# EAGLE design RHD2000_plating_board (EAGLE 6.5.0)
RHD2000 Evaluation Board

## Sheet 1 of 4
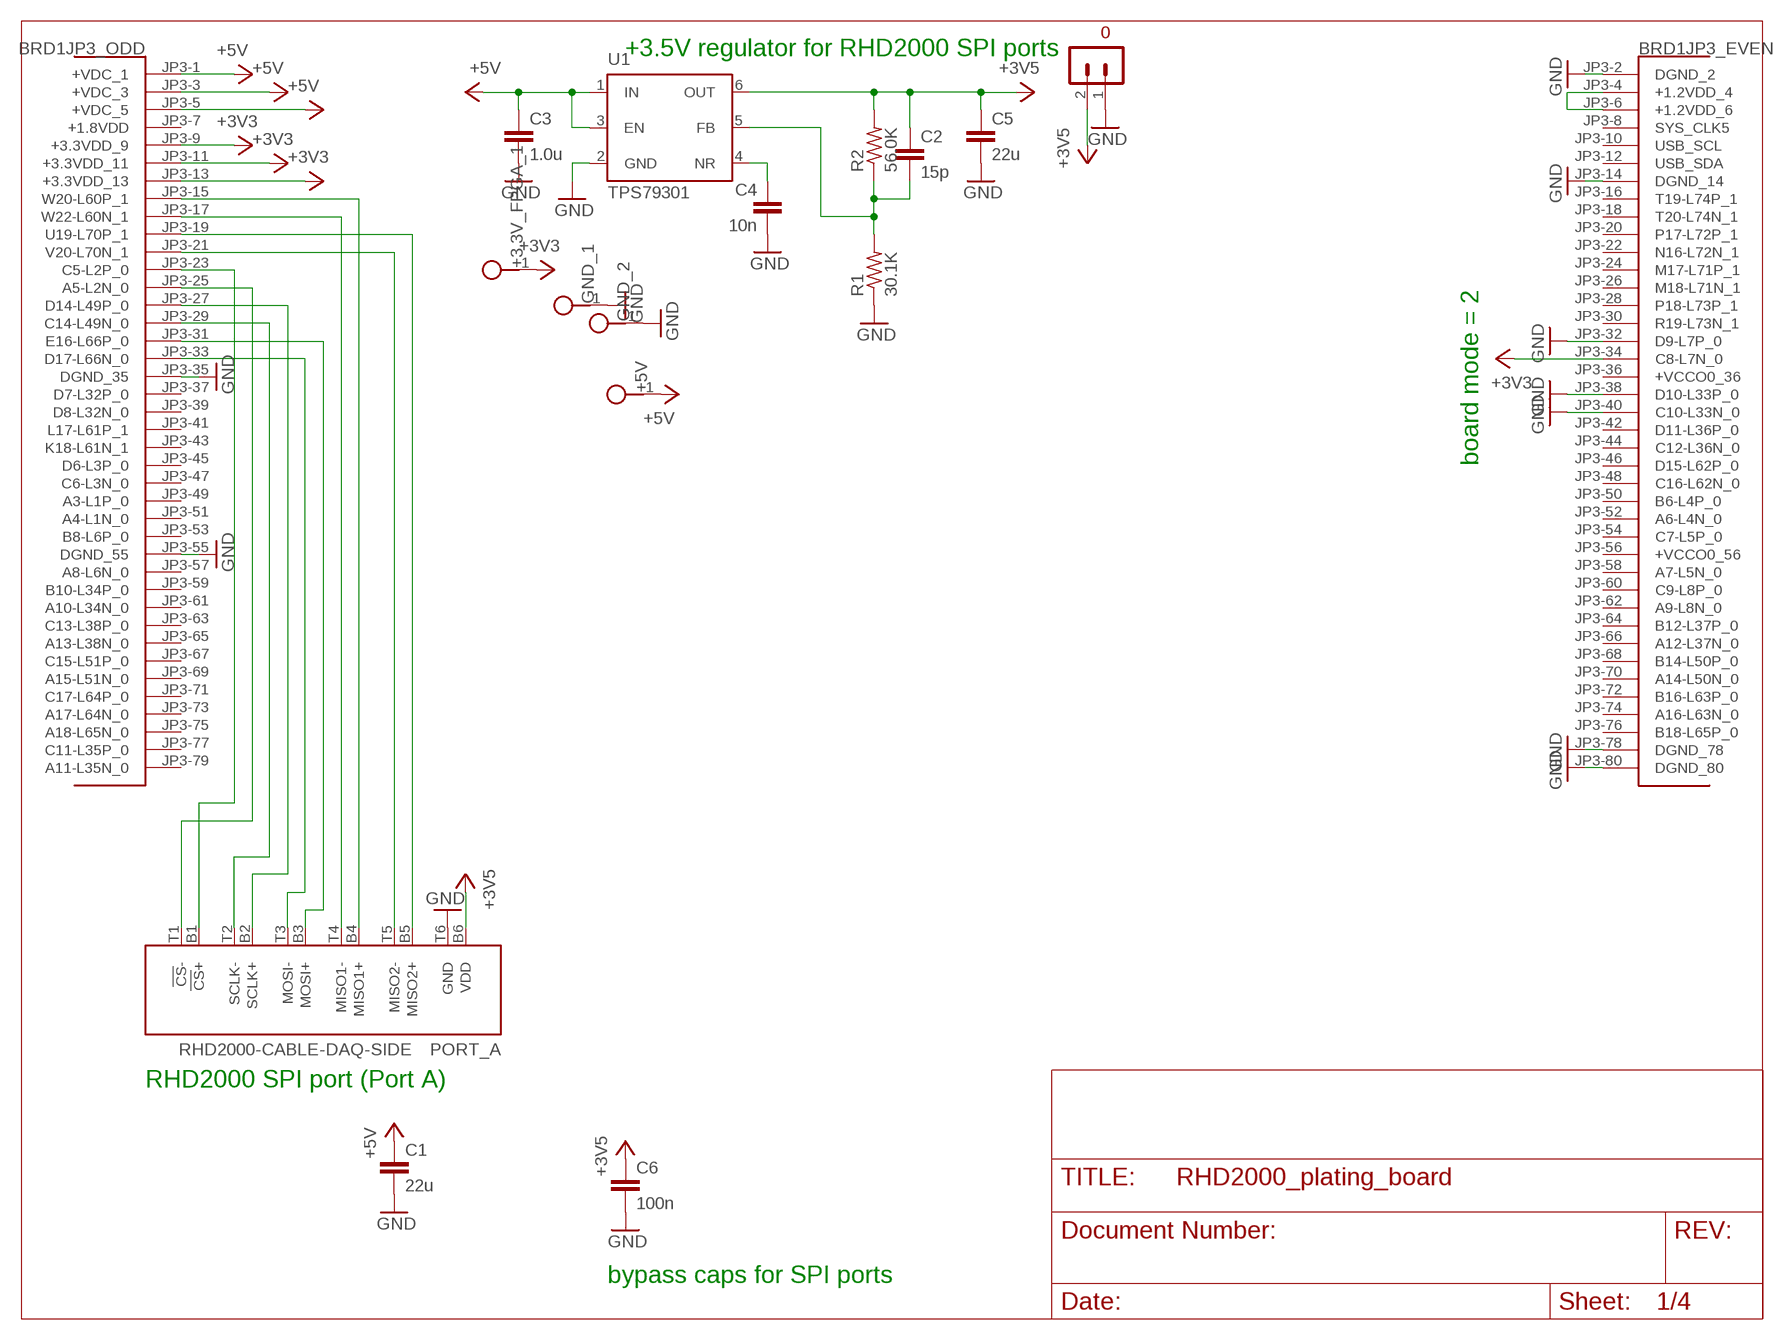
[diagram p0: schematic, sheet 1]

### Parts
+3.3V_FPGA_1  TESTPOINT  [TESTPOINT]
+5V  TESTPOINT  [TESTPOINT]
BRD1  OPALKELLY_XEM6010  [OPALKELLY_XEM6010]
C1  22u  C_1206  [1206]
C2  15p  C_0603  [0603]
C3  1.0u  C_0805  [0805]
C4  10n  C_0603  [0603]
C5  22u  C_1206  [1206]
C6  100n  C_0603  [0603]
GND_1  TESTPOINT  [TESTPOINT]
GND_2  TESTPOINT  [TESTPOINT]
PORT_A  RHD2000-CABLE-DAQ-SIDE  [OMNETICS_PZN-12-AA]
R1  30.1K  R_0603  [0603]
R2  56.0K  R_0603  [0603]
S2  TERMINAL_BLOCK_2-3.5MM-3.5V  [TERMINAL_BLOCK_3.5MM_2_3.5V]
U1  TPS79301  [SOT-23-6]

### Nets
+3V3 [power]: +3.3V_FPGA_1.1 BRD1.JP3-9(JP3_ODD:+3.3VDD_9) BRD1.JP3-11(JP3_ODD:+3.3VDD_11) BRD1.JP3-13(JP3_ODD:+3.3VDD_13) BRD1.JP3-34(JP3_EVEN:C8-L7N_0) ; also sheet 3
+3V5 [power]: C2.1 C5.1 C6.1 PORT_A.B6(VDD) R2.2 S2.2 U1.6(OUT)
+5V [power]: +5V.1 BRD1.JP3-1(JP3_ODD:+VDC_1) BRD1.JP3-3(JP3_ODD:+VDC_3) BRD1.JP3-5(JP3_ODD:+VDC_5) C1.1 C3.1 U1.1(IN) U1.3(EN) ; also sheet 4
GND [power]: BRD1.JP3-2(JP3_EVEN:DGND_2) BRD1.JP3-14(JP3_EVEN:DGND_14) BRD1.JP3-32(JP3_EVEN:D9-L7P_0) BRD1.JP3-35(JP3_ODD:DGND_35) BRD1.JP3-38(JP3_EVEN:D10-L33P_0) BRD1.JP3-40(JP3_EVEN:C10-L33N_0) BRD1.JP3-55(JP3_ODD:DGND_55) BRD1.JP3-78(JP3_EVEN:DGND_78) BRD1.JP3-80(JP3_EVEN:DGND_80) C1.2 C3.2 C4.2 C5.2 C6.2 GND_1.1 GND_2.1 PORT_A.T6(GND) R1.1 S2.1 U1.2(GND) ; also sheet 2,3,4
N$1: BRD1.JP3-15(JP3_ODD:W20-L60P_1) PORT_A.B4(MISO1+)
N$2: BRD1.JP3-17(JP3_ODD:W22-L60N_1) PORT_A.T4(MISO1-)
N$3: BRD1.JP3-19(JP3_ODD:U19-L70P_1) PORT_A.B5(MISO2+)
N$4: BRD1.JP3-21(JP3_ODD:V20-L70N_1) PORT_A.T5(MISO2-)
N$5: BRD1.JP3-23(JP3_ODD:C5-L2P_0) PORT_A.B1(!CS!+)
N$6: BRD1.JP3-25(JP3_ODD:A5-L2N_0) PORT_A.T1(!CS!-)
N$7: BRD1.JP3-27(JP3_ODD:D14-L49P_0) PORT_A.B2(SCLK+)
N$8: BRD1.JP3-29(JP3_ODD:C14-L49N_0) PORT_A.T2(SCLK-)
N$9: BRD1.JP3-31(JP3_ODD:E16-L66P_0) PORT_A.B3(MOSI+)
N$10: BRD1.JP3-33(JP3_ODD:D17-L66N_0) PORT_A.T3(MOSI-)
N$143: C4.1 U1.4(NR)
N$144: C2.2 R1.2 R2.1 U1.5(FB)
N$185 [power]: BRD1.JP3-4(JP3_EVEN:+1.2VDD_4) BRD1.JP3-6(JP3_EVEN:+1.2VDD_6)
Unconnected: BRD1.JP3-8(JP3_EVEN:SYS_CLK5) BRD1.JP3-10(JP3_EVEN:USB_SCL) BRD1.JP3-12(JP3_EVEN:USB_SDA) BRD1.JP3-16(JP3_EVEN:T19-L74P_1) BRD1.JP3-18(JP3_EVEN:T20-L74N_1) BRD1.JP3-20(JP3_EVEN:P17-L72P_1) BRD1.JP3-22(JP3_EVEN:N16-L72N_1) BRD1.JP3-24(JP3_EVEN:M17-L71P_1) BRD1.JP3-26(JP3_EVEN:M18-L71N_1) BRD1.JP3-28(JP3_EVEN:P18-L73P_1) BRD1.JP3-30(JP3_EVEN:R19-L73N_1) BRD1.JP3-37(JP3_ODD:D7-L32P_0) BRD1.JP3-39(JP3_ODD:D8-L32N_0) BRD1.JP3-41(JP3_ODD:L17-L61P_1) BRD1.JP3-42(JP3_EVEN:D11-L36P_0) BRD1.JP3-43(JP3_ODD:K18-L61N_1) BRD1.JP3-44(JP3_EVEN:C12-L36N_0) BRD1.JP3-45(JP3_ODD:D6-L3P_0) BRD1.JP3-46(JP3_EVEN:D15-L62P_0) BRD1.JP3-47(JP3_ODD:C6-L3N_0) BRD1.JP3-48(JP3_EVEN:C16-L62N_0) BRD1.JP3-49(JP3_ODD:A3-L1P_0) BRD1.JP3-50(JP3_EVEN:B6-L4P_0) BRD1.JP3-51(JP3_ODD:A4-L1N_0) BRD1.JP3-52(JP3_EVEN:A6-L4N_0) BRD1.JP3-53(JP3_ODD:B8-L6P_0) BRD1.JP3-54(JP3_EVEN:C7-L5P_0) BRD1.JP3-57(JP3_ODD:A8-L6N_0) BRD1.JP3-58(JP3_EVEN:A7-L5N_0) BRD1.JP3-59(JP3_ODD:B10-L34P_0) BRD1.JP3-60(JP3_EVEN:C9-L8P_0) BRD1.JP3-61(JP3_ODD:A10-L34N_0) BRD1.JP3-62(JP3_EVEN:A9-L8N_0) BRD1.JP3-63(JP3_ODD:C13-L38P_0) BRD1.JP3-64(JP3_EVEN:B12-L37P_0) BRD1.JP3-65(JP3_ODD:A13-L38N_0) BRD1.JP3-66(JP3_EVEN:A12-L37N_0) BRD1.JP3-67(JP3_ODD:C15-L51P_0) BRD1.JP3-68(JP3_EVEN:B14-L50P_0) BRD1.JP3-69(JP3_ODD:A15-L51N_0) BRD1.JP3-70(JP3_EVEN:A14-L50N_0) BRD1.JP3-71(JP3_ODD:C17-L64P_0) BRD1.JP3-72(JP3_EVEN:B16-L63P_0) BRD1.JP3-73(JP3_ODD:A17-L64N_0) BRD1.JP3-74(JP3_EVEN:A16-L63N_0) BRD1.JP3-75(JP3_ODD:A18-L65N_0) BRD1.JP3-76(JP3_EVEN:B18-L65P_0) BRD1.JP3-77(JP3_ODD:C11-L35P_0) BRD1.JP3-79(JP3_ODD:A11-L35N_0)

### Notes on the sheet
- +3.5V regulator for RHD2000 SPI ports
- board mode = 2
- RHD2000 SPI port (Port A)
- bypass caps for SPI ports

## Sheet 2 of 4
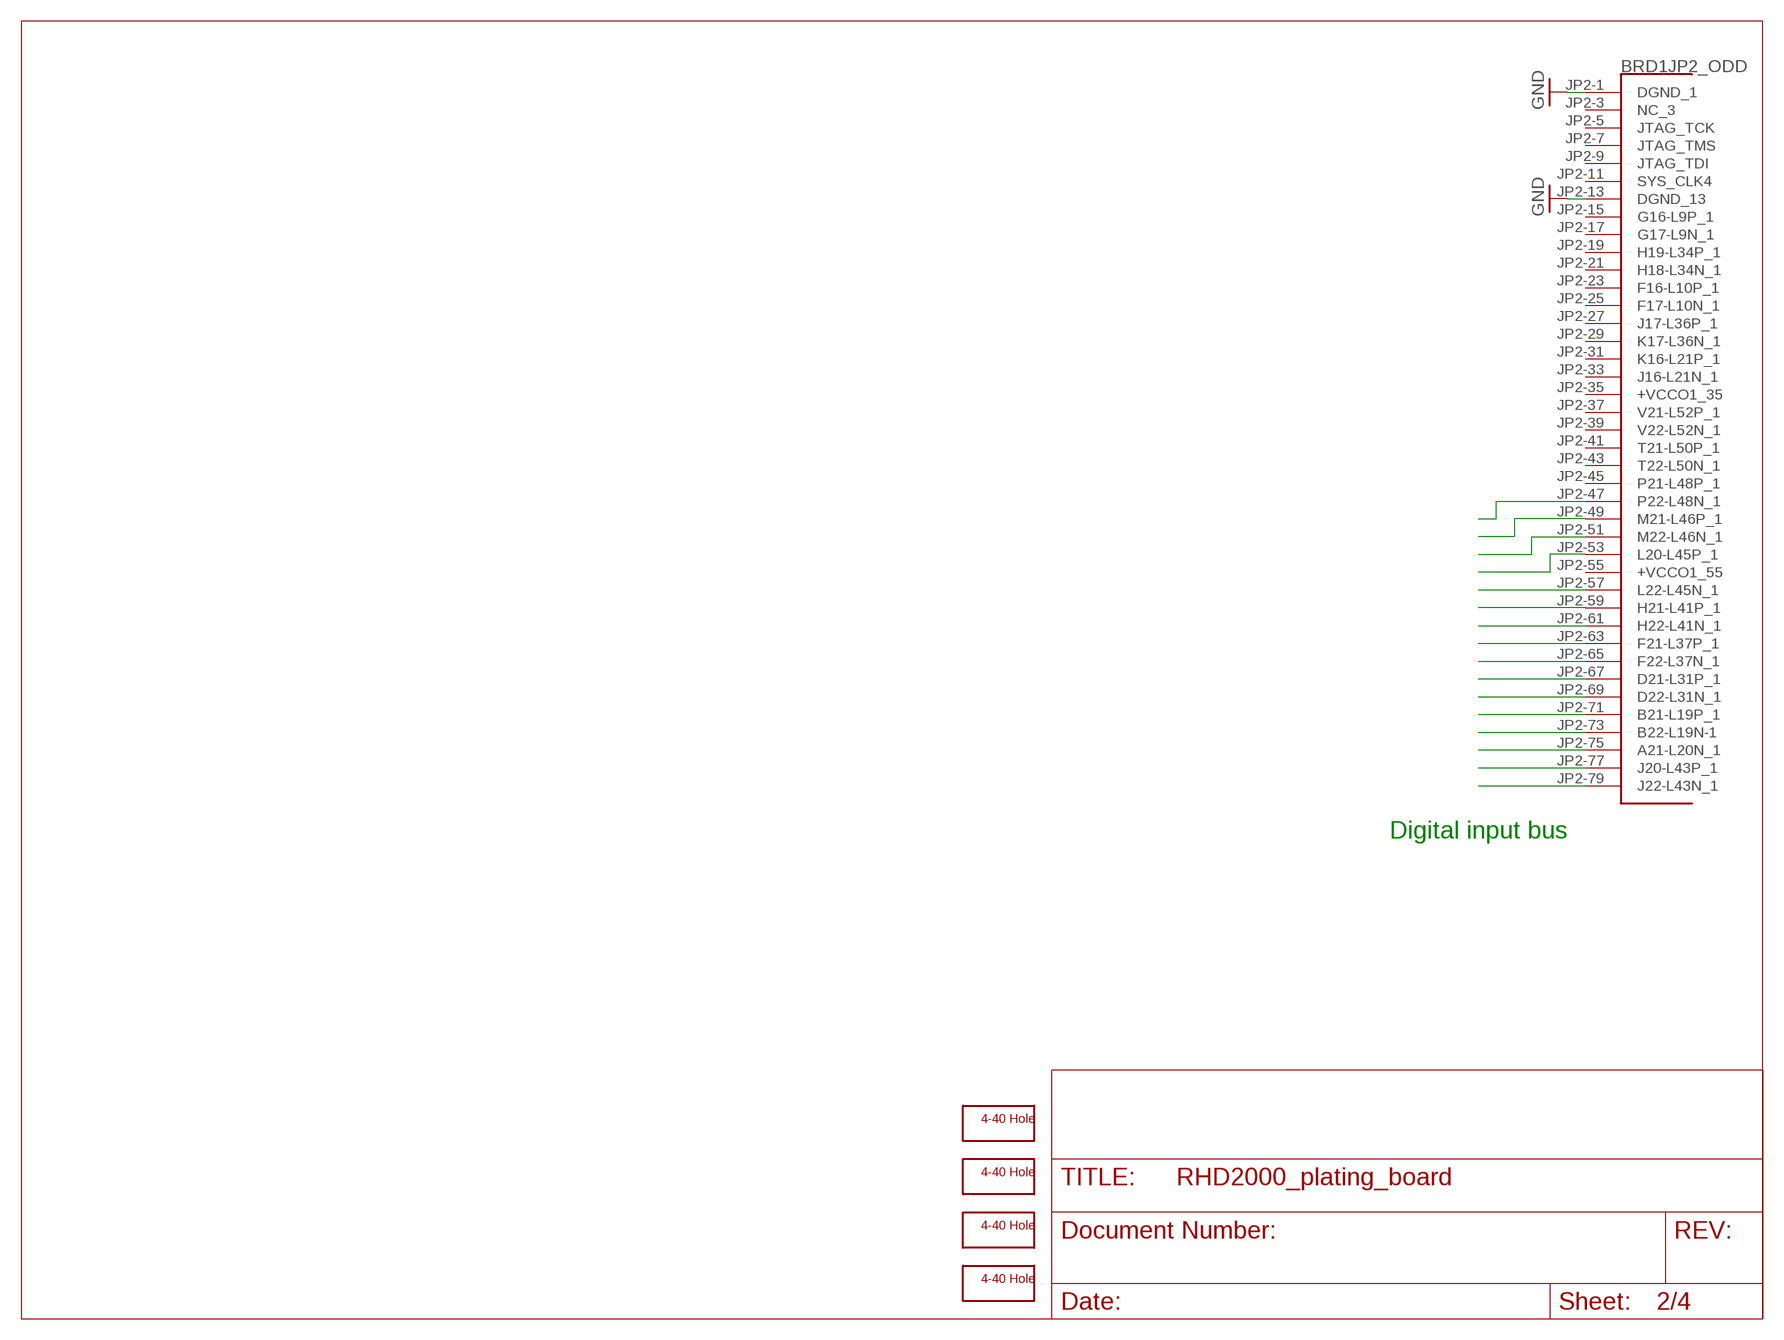
[diagram p1: schematic, sheet 2]

### Parts
H1  SCREW_HOLE_4-40  [SCREW_HOLE_4-40]
H2  SCREW_HOLE_4-40  [SCREW_HOLE_4-40]
H3  SCREW_HOLE_4-40  [SCREW_HOLE_4-40]
H4  SCREW_HOLE_4-40  [SCREW_HOLE_4-40]

### Nets
GND [power]: BRD1.JP2-1(JP2_ODD:DGND_1) BRD1.JP2-13(JP2_ODD:DGND_13) ; also sheet 1,3,4
N$68: BRD1.JP2-79(JP2_ODD:J22-L43N_1)
N$69: BRD1.JP2-77(JP2_ODD:J20-L43P_1)
N$70: BRD1.JP2-75(JP2_ODD:A21-L20N_1)
N$71: BRD1.JP2-73(JP2_ODD:B22-L19N-1)
N$72: BRD1.JP2-71(JP2_ODD:B21-L19P_1)
N$73: BRD1.JP2-69(JP2_ODD:D22-L31N_1)
N$74: BRD1.JP2-67(JP2_ODD:D21-L31P_1)
N$75: BRD1.JP2-65(JP2_ODD:F22-L37N_1)
N$76: BRD1.JP2-63(JP2_ODD:F21-L37P_1)
N$77: BRD1.JP2-61(JP2_ODD:H22-L41N_1)
N$78: BRD1.JP2-59(JP2_ODD:H21-L41P_1)
N$79: BRD1.JP2-57(JP2_ODD:L22-L45N_1)
N$80: BRD1.JP2-53(JP2_ODD:L20-L45P_1)
N$81: BRD1.JP2-51(JP2_ODD:M22-L46N_1)
N$82: BRD1.JP2-49(JP2_ODD:M21-L46P_1)
N$83: BRD1.JP2-47(JP2_ODD:P22-L48N_1)
Unconnected: BRD1.JP2-3(JP2_ODD:NC_3) BRD1.JP2-5(JP2_ODD:JTAG_TCK) BRD1.JP2-7(JP2_ODD:JTAG_TMS) BRD1.JP2-9(JP2_ODD:JTAG_TDI) BRD1.JP2-11(JP2_ODD:SYS_CLK4) BRD1.JP2-15(JP2_ODD:G16-L9P_1) BRD1.JP2-17(JP2_ODD:G17-L9N_1) BRD1.JP2-19(JP2_ODD:H19-L34P_1) BRD1.JP2-21(JP2_ODD:H18-L34N_1) BRD1.JP2-23(JP2_ODD:F16-L10P_1) BRD1.JP2-25(JP2_ODD:F17-L10N_1) BRD1.JP2-27(JP2_ODD:J17-L36P_1) BRD1.JP2-29(JP2_ODD:K17-L36N_1) BRD1.JP2-31(JP2_ODD:K16-L21P_1) BRD1.JP2-33(JP2_ODD:J16-L21N_1) BRD1.JP2-37(JP2_ODD:V21-L52P_1) BRD1.JP2-39(JP2_ODD:V22-L52N_1) BRD1.JP2-41(JP2_ODD:T21-L50P_1) BRD1.JP2-43(JP2_ODD:T22-L50N_1) BRD1.JP2-45(JP2_ODD:P21-L48P_1)

### Notes on the sheet
- Digital input bus

## Sheet 3 of 4
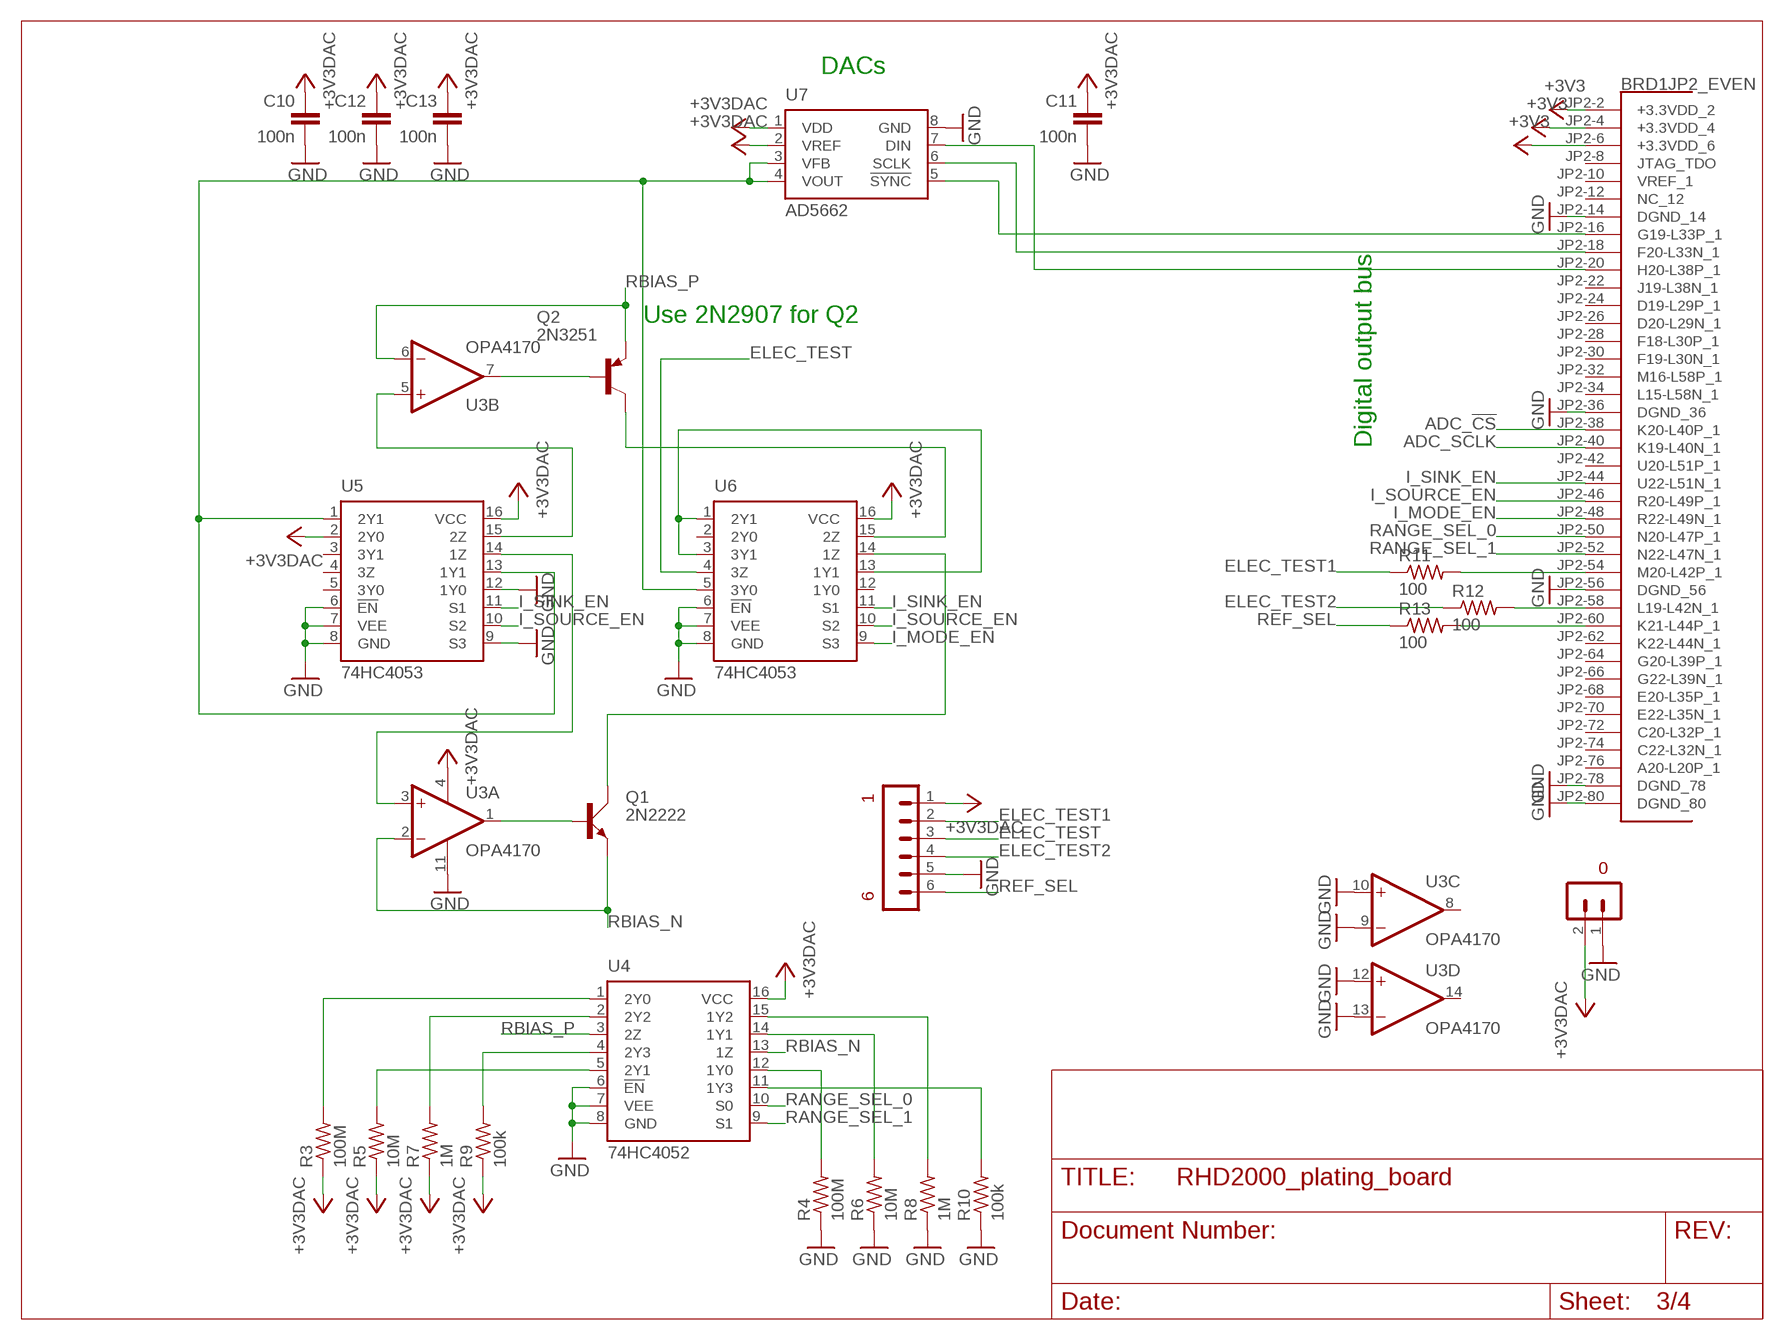
[diagram p2: schematic, sheet 3]

### Parts
C10  100n  C_0603  [0603]
C11  100n  C_0603  [0603]
C12  100n  C_0603  [0603]
C13  100n  C_0603  [0603]
Q1  2N2222  [TO18A]
Q2  2N3251  [TO18]
R3  100M  R_1206  [1206]
R4  100M  R_1206  [1206]
R5  10M  R_0603  [0603]
R6  10M  R_0603  [0603]
R7  1M  R_0603  [0603]
R8  1M  R_0603  [0603]
R9  100k  R_0603  [0603]
R10  100k  R_0603  [0603]
R11  100  R_0603  [0603]
R12  100  R_0603  [0603]
R13  100  R_0603  [0603]
S1  TERMINAL_BLOCK_2-3.5MM-3.3V  [TERMINAL_BLOCK_3.5MM_2_3.3V]
S3  WIRES-6  [WIRES-6]
U3  OPA4170  OPA4170_SO14  [SOIC-14]
U4  74HC4052  74HC4052_TSSOP-16  [TSSOP-16]
U5  74HC4053  74HC4053_TSSOP-16  [TSSOP-16]
U6  74HC4053  74HC4053_TSSOP-16  [TSSOP-16]
U7  AD5662  AD5662-SOT-23  [SOT-23-RJ-8]

### Nets
+3V3 [power]: BRD1.JP2-2(JP2_EVEN:+3.3VDD_2) BRD1.JP2-4(JP2_EVEN:+3.3VDD_4) BRD1.JP2-6(JP2_EVEN:+3.3VDD_6) ; also sheet 1
+3V3DAC [power]: C10.1 C11.1 C12.1 C13.1 R3.1 R5.1 R7.1 R9.1 S1.2 S3.1 U3.4(P:V+) U4.16(VCC) U5.2(2Y0) U5.16(VCC) U6.16(VCC) U7.1(VDD) U7.2(VREF) ; also sheet 4
ADC_!CS!: BRD1.JP2-38(JP2_EVEN:K20-L40P_1)
ADC_SCLK: BRD1.JP2-40(JP2_EVEN:K19-L40N_1)
ELEC_TEST: S3.3 U6.4(3Z)
ELEC_TEST1: R11.1 S3.2
ELEC_TEST2: R12.1 S3.4
GND [power]: BRD1.JP2-14(JP2_EVEN:DGND_14) BRD1.JP2-36(JP2_EVEN:DGND_36) BRD1.JP2-56(JP2_EVEN:DGND_56) BRD1.JP2-78(JP2_EVEN:DGND_78) BRD1.JP2-80(JP2_EVEN:DGND_80) C10.2 C11.2 C12.2 C13.2 R4.1 R6.1 R8.1 R10.1 S1.1 S3.5 U3.9(C:-IN) U3.10(C:+IN) U3.11(P:V-) U3.12(D:+IN) U3.13(D:-IN) U4.6(!EN!) U4.7(VEE) U4.8(GND) U5.6(!EN!) U5.7(VEE) U5.8(GND) U5.9(S3) U5.12(1Y0) U6.6(!EN!) U6.7(VEE) U6.8(GND) U7.8(GND) ; also sheet 1,2,4
I_MODE_EN: BRD1.JP2-48(JP2_EVEN:R22-L49N_1) U6.9(S3)
I_SINK_EN: BRD1.JP2-44(JP2_EVEN:U22-L51N_1) U5.11(S1) U6.11(S1)
I_SOURCE_EN: BRD1.JP2-46(JP2_EVEN:R20-L49P_1) U5.10(S2) U6.10(S2)
N$11: Q1.B U3.1(A:OUT)
N$12: U5.1(2Y1) U5.13(1Y1) U6.5(3Y0) U7.3(VFB) U7.4(VOUT)
N$13: U3.3(A:+IN) U5.14(1Z)
N$14: Q1.C U6.14(1Z)
N$15: U3.5(B:+IN) U5.15(2Z)
N$16: Q2.2(B) U3.7(B:OUT)
N$17: Q2.3(C) U6.15(2Z)
N$18: BRD1.JP2-54(JP2_EVEN:M20-L42P_1) R11.2
N$19: BRD1.JP2-58(JP2_EVEN:L19-L42N_1) R12.2
N$20: R9.2 U4.4(2Y3)
N$21: R7.2 U4.2(2Y2)
N$22: R5.2 U4.5(2Y1)
N$23: R3.2 U4.1(2Y0)
N$24: R4.2 U4.12(1Y0)
N$25: R6.2 U4.14(1Y1)
N$26: R8.2 U4.15(1Y2)
N$27: R10.2 U4.11(1Y3)
N$28: U6.1(2Y1) U6.3(3Y1) U6.13(1Y1)
N$29: BRD1.JP2-60(JP2_EVEN:K21-L44P_1) R13.2
N$41: BRD1.JP2-16(JP2_EVEN:G19-L33P_1) U7.5(!SYNC!)
N$42: BRD1.JP2-18(JP2_EVEN:F20-L33N_1) U7.6(SCLK)
N$43: BRD1.JP2-20(JP2_EVEN:H20-L38P_1) U7.7(DIN)
RANGE_SEL_0: BRD1.JP2-50(JP2_EVEN:N20-L47P_1) U4.10(S0)
RANGE_SEL_1: BRD1.JP2-52(JP2_EVEN:N22-L47N_1) U4.9(S1)
RBIAS_N: Q1.E U3.2(A:-IN) U4.13(1Z)
RBIAS_P: Q2.1(E) U3.6(B:-IN) U4.3(2Z)
REF_SEL: R13.1 S3.6
Unconnected: BRD1.JP2-8(JP2_EVEN:JTAG_TDO) BRD1.JP2-10(JP2_EVEN:VREF_1) BRD1.JP2-12(JP2_EVEN:NC_12) BRD1.JP2-22(JP2_EVEN:J19-L38N_1) BRD1.JP2-24(JP2_EVEN:D19-L29P_1) BRD1.JP2-26(JP2_EVEN:D20-L29N_1) BRD1.JP2-28(JP2_EVEN:F18-L30P_1) BRD1.JP2-30(JP2_EVEN:F19-L30N_1) BRD1.JP2-32(JP2_EVEN:M16-L58P_1) BRD1.JP2-34(JP2_EVEN:L15-L58N_1) BRD1.JP2-42(JP2_EVEN:U20-L51P_1) BRD1.JP2-62(JP2_EVEN:K22-L44N_1) BRD1.JP2-64(JP2_EVEN:G20-L39P_1) BRD1.JP2-66(JP2_EVEN:G22-L39N_1) BRD1.JP2-68(JP2_EVEN:E20-L35P_1) BRD1.JP2-70(JP2_EVEN:E22-L35N_1) BRD1.JP2-72(JP2_EVEN:C20-L32P_1) BRD1.JP2-74(JP2_EVEN:C22-L32N_1) BRD1.JP2-76(JP2_EVEN:A20-L20P_1) U3.8(C:OUT) U3.14(D:OUT) U5.3(3Y1) U5.4(3Z) U5.5(3Y0) U6.2(2Y0) U6.12(1Y0)

### Notes on the sheet
- DACs
- Use 2N2907 for Q2
- Digital output bus

## Sheet 4 of 4
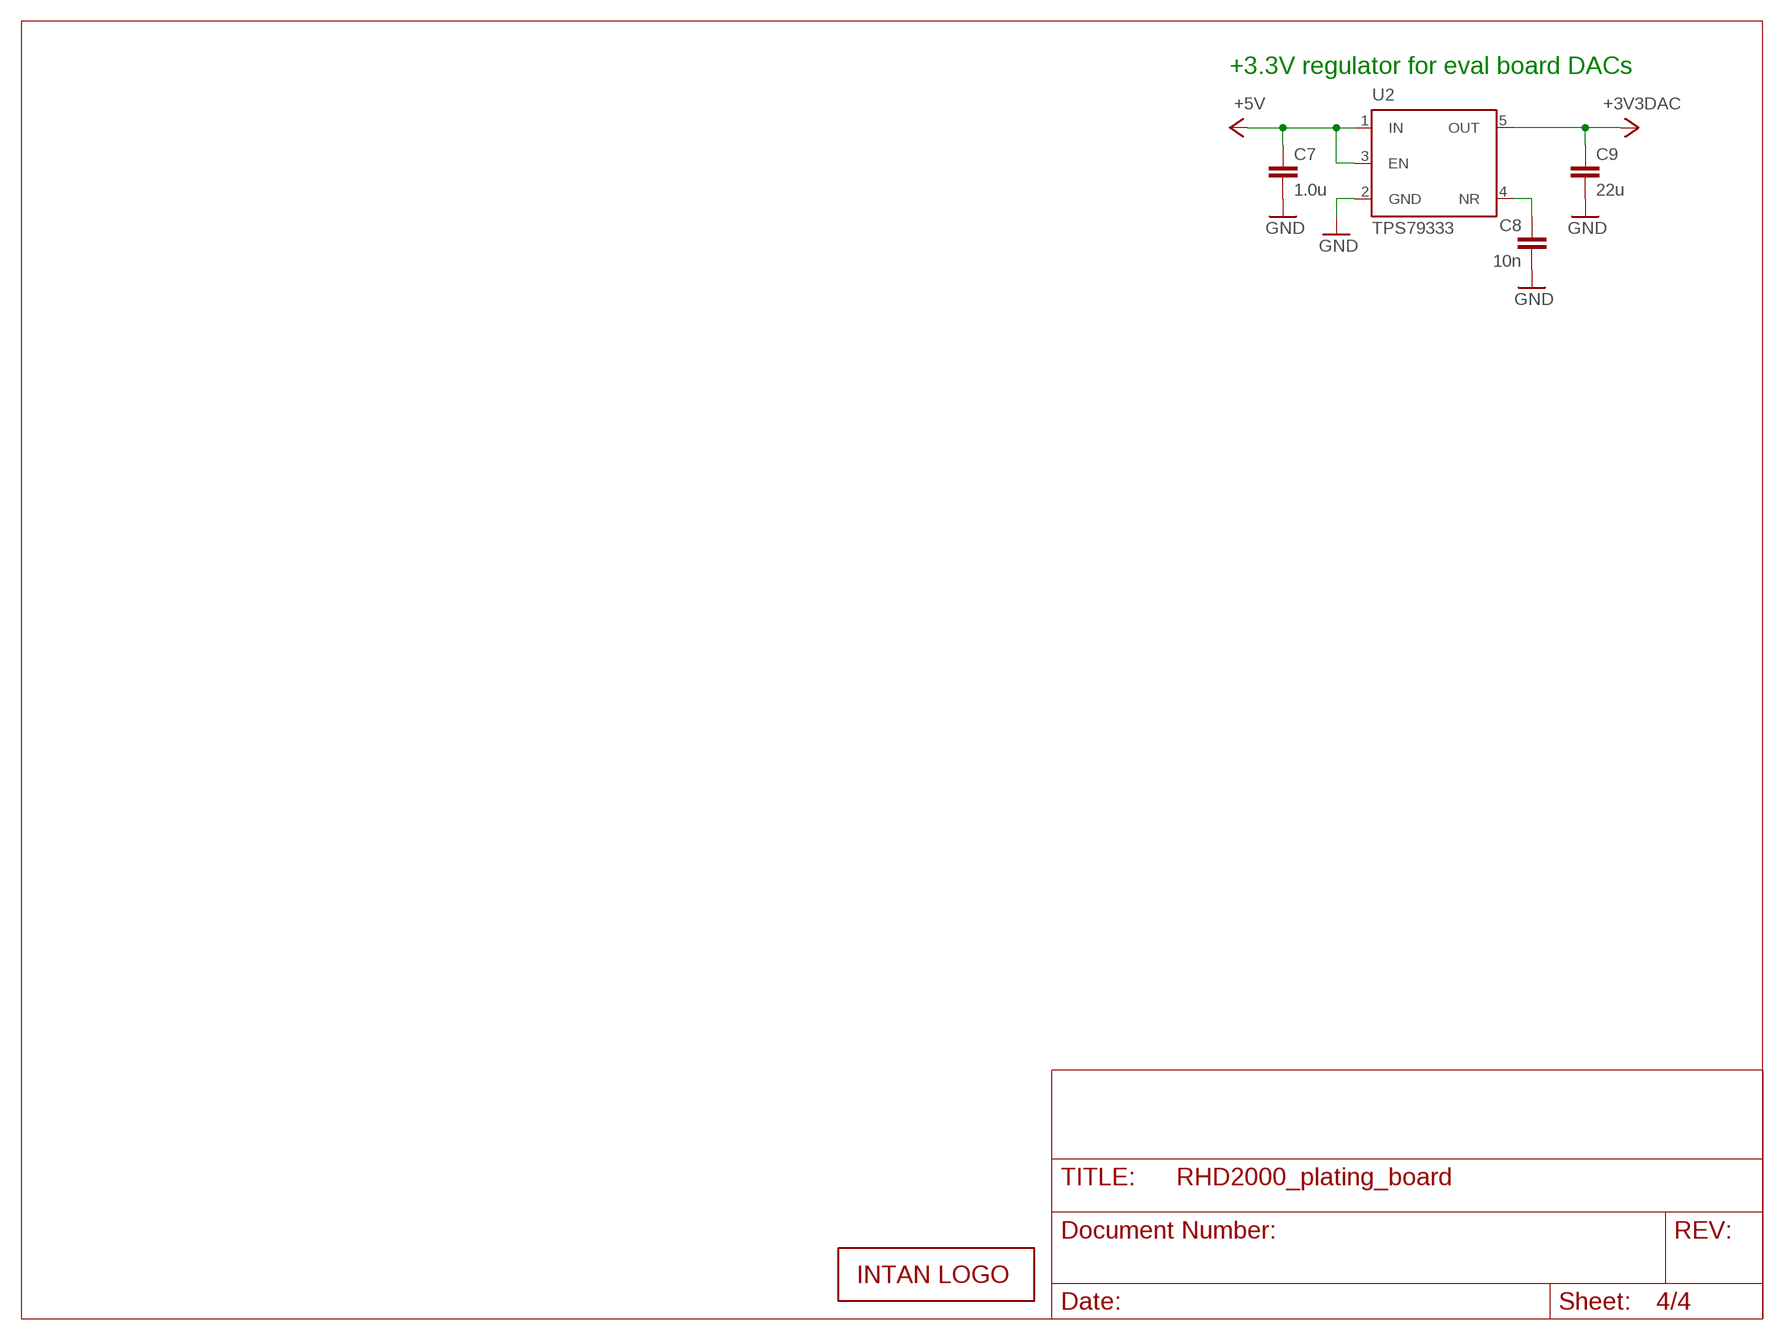
[diagram p3: schematic, sheet 4]

### Parts
C7  1.0u  C_0805  [0805]
C8  10n  C_0603  [0603]
C9  22u  C_1206  [1206]
LOGO1  INTAN_LOGO  [INTAN_LOGO]
U2  TPS79333  [SOT-23-5]

### Nets
+3V3DAC [power]: C9.1 U2.5(OUT) ; also sheet 3
+5V [power]: C7.1 U2.1(IN) U2.3(EN) ; also sheet 1
GND [power]: C7.2 C8.2 C9.2 U2.2(GND) ; also sheet 1,2,3
N$141: C8.1 U2.4(NR)

### Notes on the sheet
- +3.3V regulator for eval board DACs

## Power pins joined to a net without a drawn wire
+1.8VDD: BRD1.JP3-7(JP3_ODD:+1.8VDD)
+VCCO0_36: BRD1.JP3-36(JP3_EVEN:+VCCO0_36)
+VCCO0_56: BRD1.JP3-56(JP3_EVEN:+VCCO0_56)
+VCCO1_35: BRD1.JP2-35(JP2_ODD:+VCCO1_35)
+VCCO1_55: BRD1.JP2-55(JP2_ODD:+VCCO1_55)

## Library data of the parts
+3.3V_FPGA_1 +5V GND_1 GND_2 = RHD2000_eval_board:TESTPOINT: PCB Test Point
BRD1 = RHD2000_eval_board:OPALKELLY_XEM6010: Opal Kelly XEM6010 USB/FPGA module
C1-C13 = RHD2000_eval_board:C: Capacitor
H1-H4 = RHD2000_eval_board:SCREW_HOLE_4-40: Mounting hole
LOGO1 = RHD2000_eval_board:INTAN_LOGO
PORT_A = RHD2000_eval_board:RHD2000-CABLE-DAQ-SIDE: Omnetics PZN-12-AA RHD2000 socket - DAQ side
Q1 = transistor-small-signal:2N2222: NPN TRANSISTOR
Q2 = transistor-pnp:2N3251: PNP Transistror
R1-R13 = RHD2000_eval_board:R: Resistor
S1 S2 = RHD2000_eval_board:TERMINAL_BLOCK_2: 2-point terminal block
S3 = harrison:WIRES-6
U1 = RHD2000_eval_board:TPS79301: Texas Instruments TPS79301 adjustable regulator
U2 = RHD2000_eval_board:TPS79333: Texas Instruments TPS79333 3.3V LDO regulator
U3 = RHD2000_eval_board:OPA4170: TI OPA4170 quad op amp
U4 = harrison:74HC4052
U5 U6 = harrison:74HC4053
U7 = RHD2000_eval_board:AD5662: Analog Devices AD5662 16-bit DAC

## Net classes
1 power: width 0.381 mm

## Board
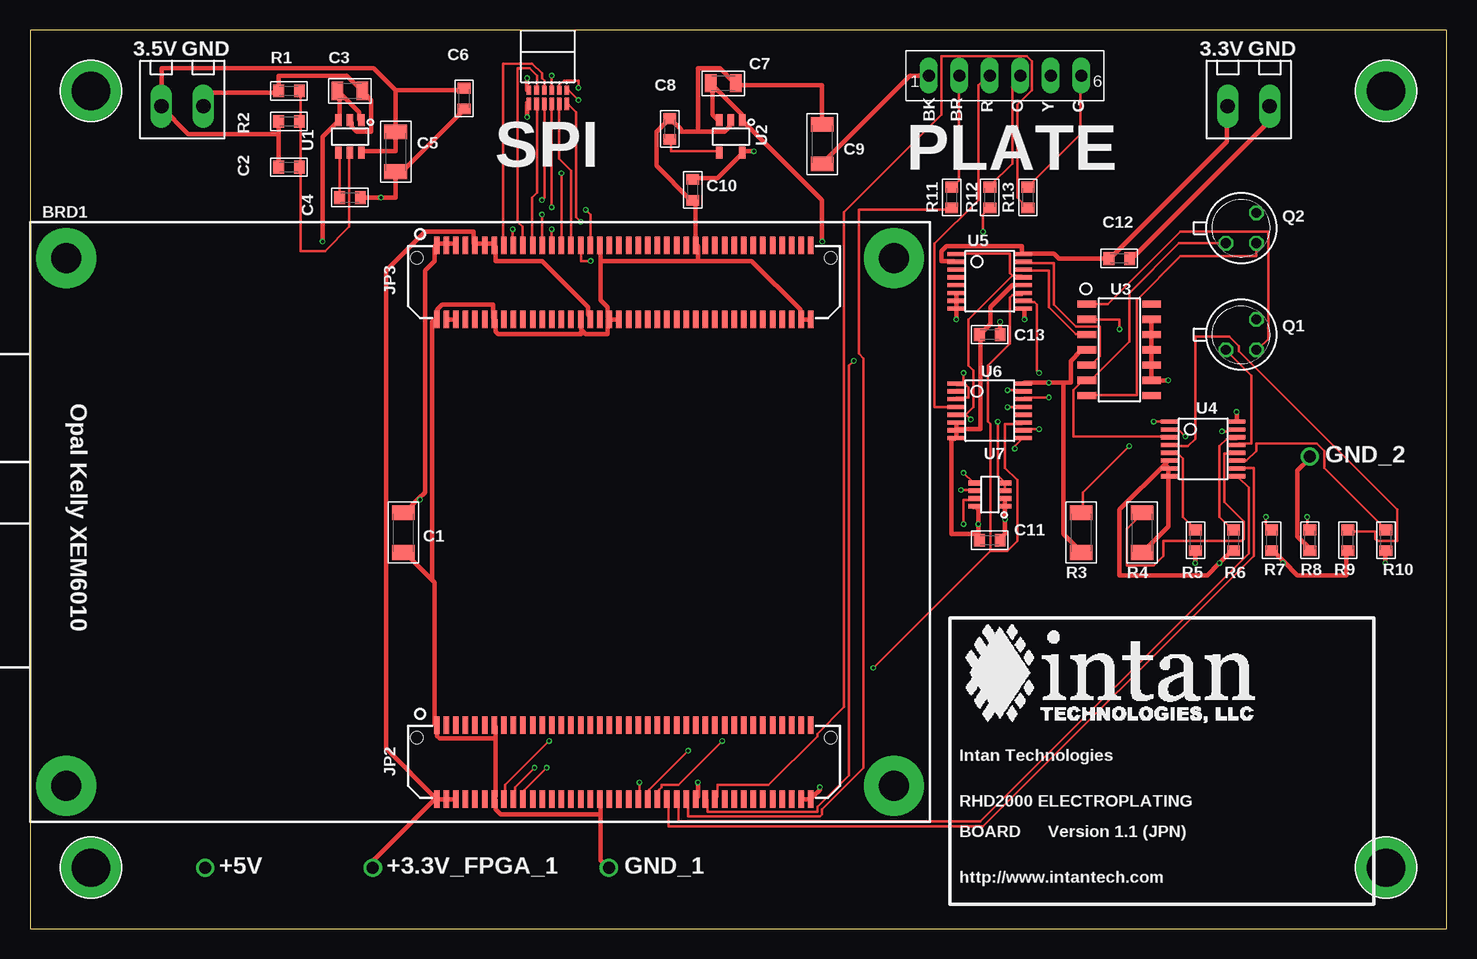
[diagram p4: board, top side]
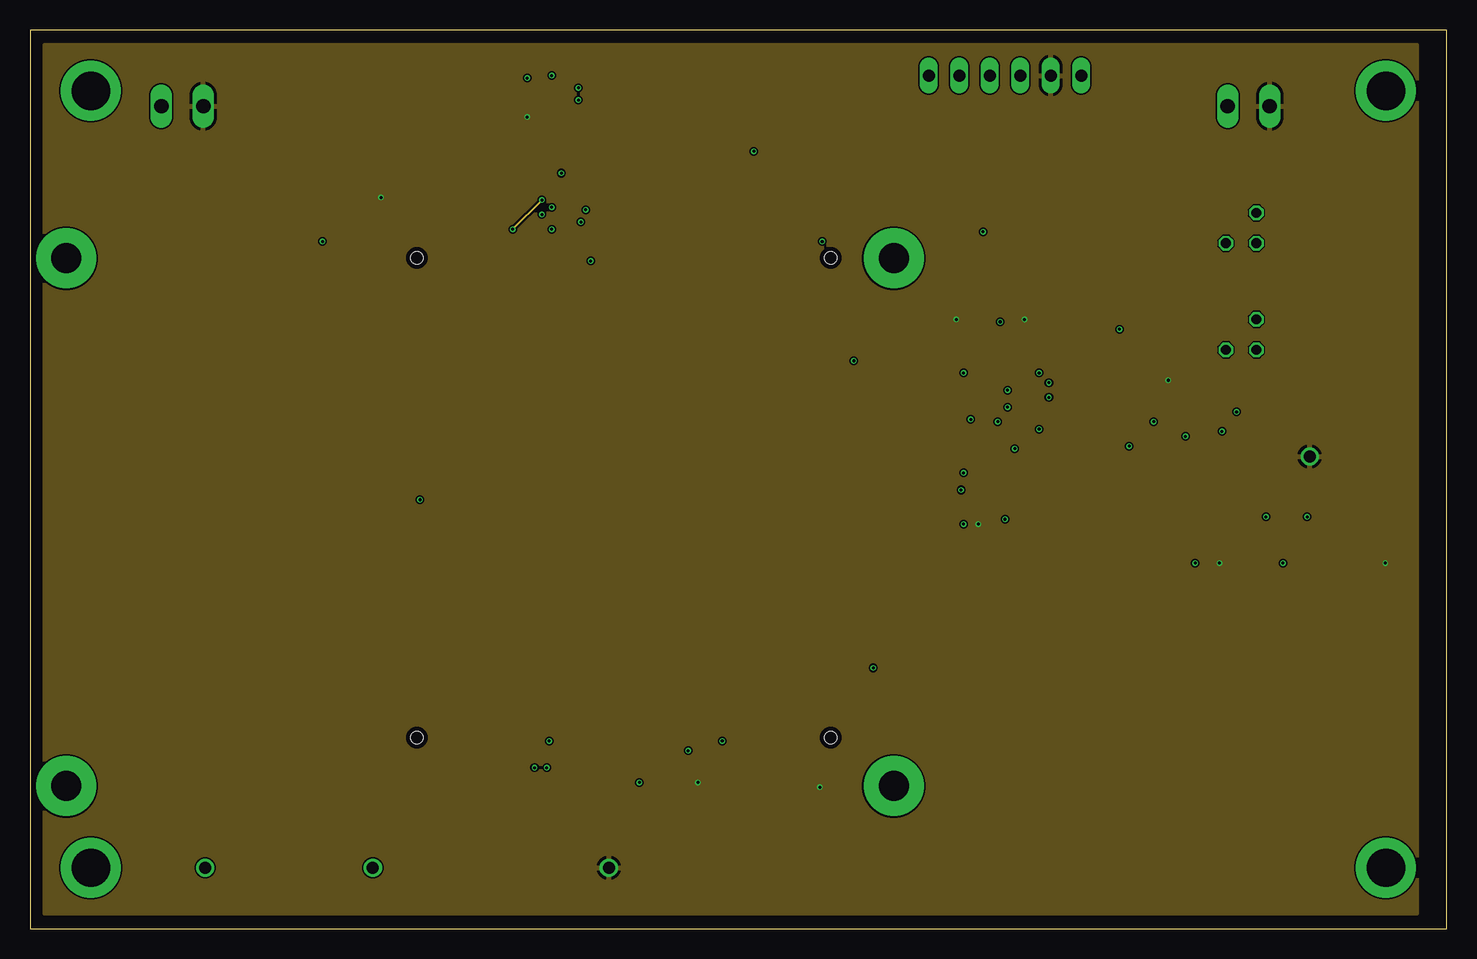
[diagram p5: board, inner layer Route2]
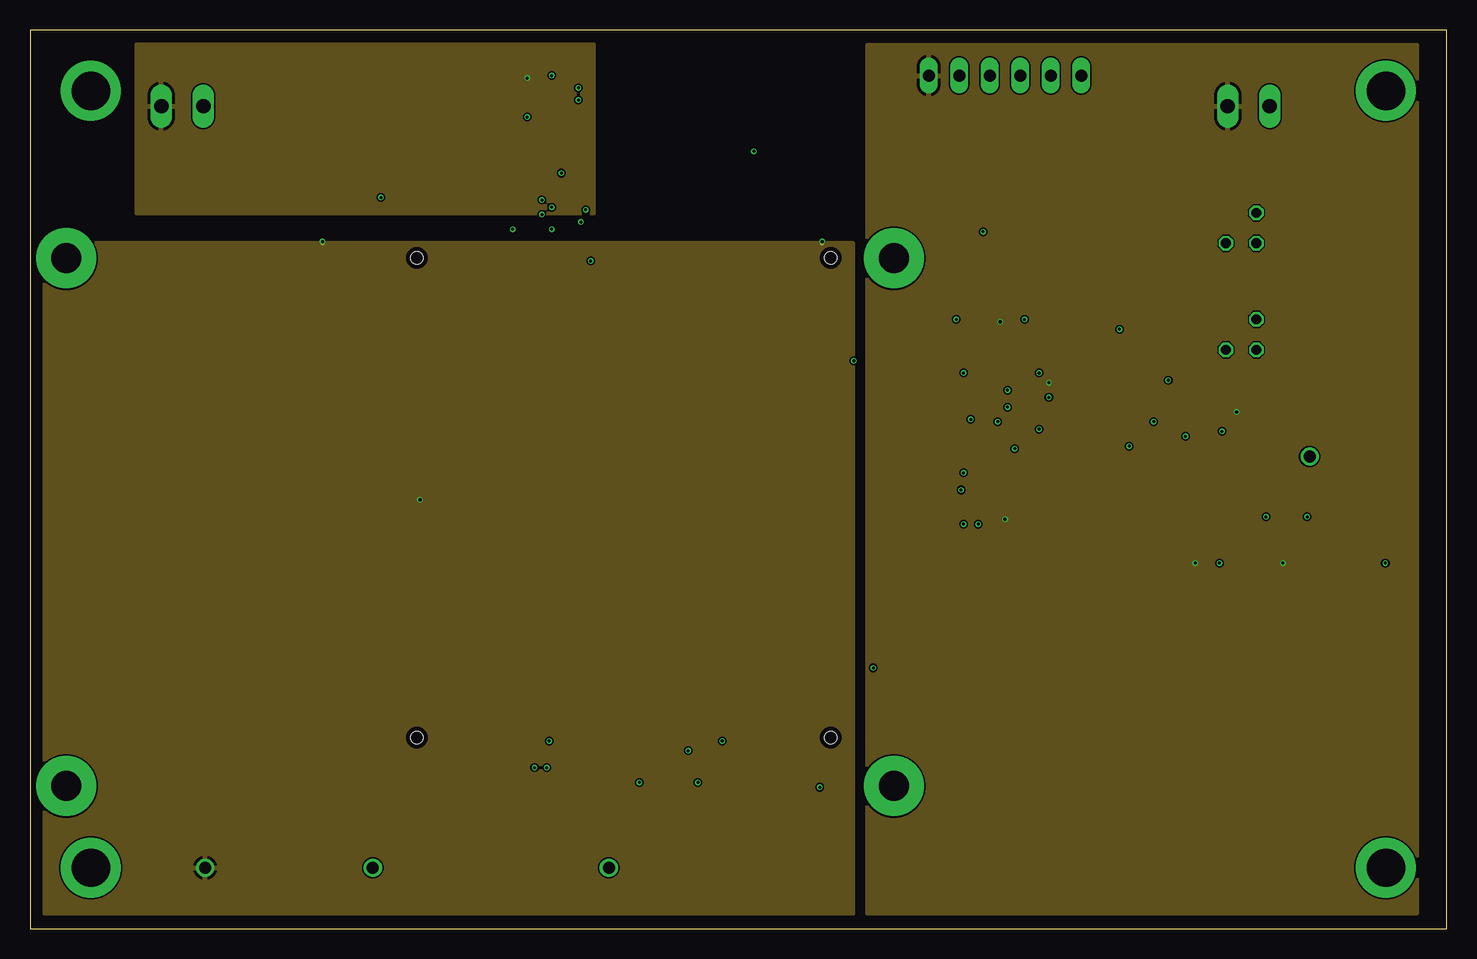
[diagram p6: board, inner layer Route15]
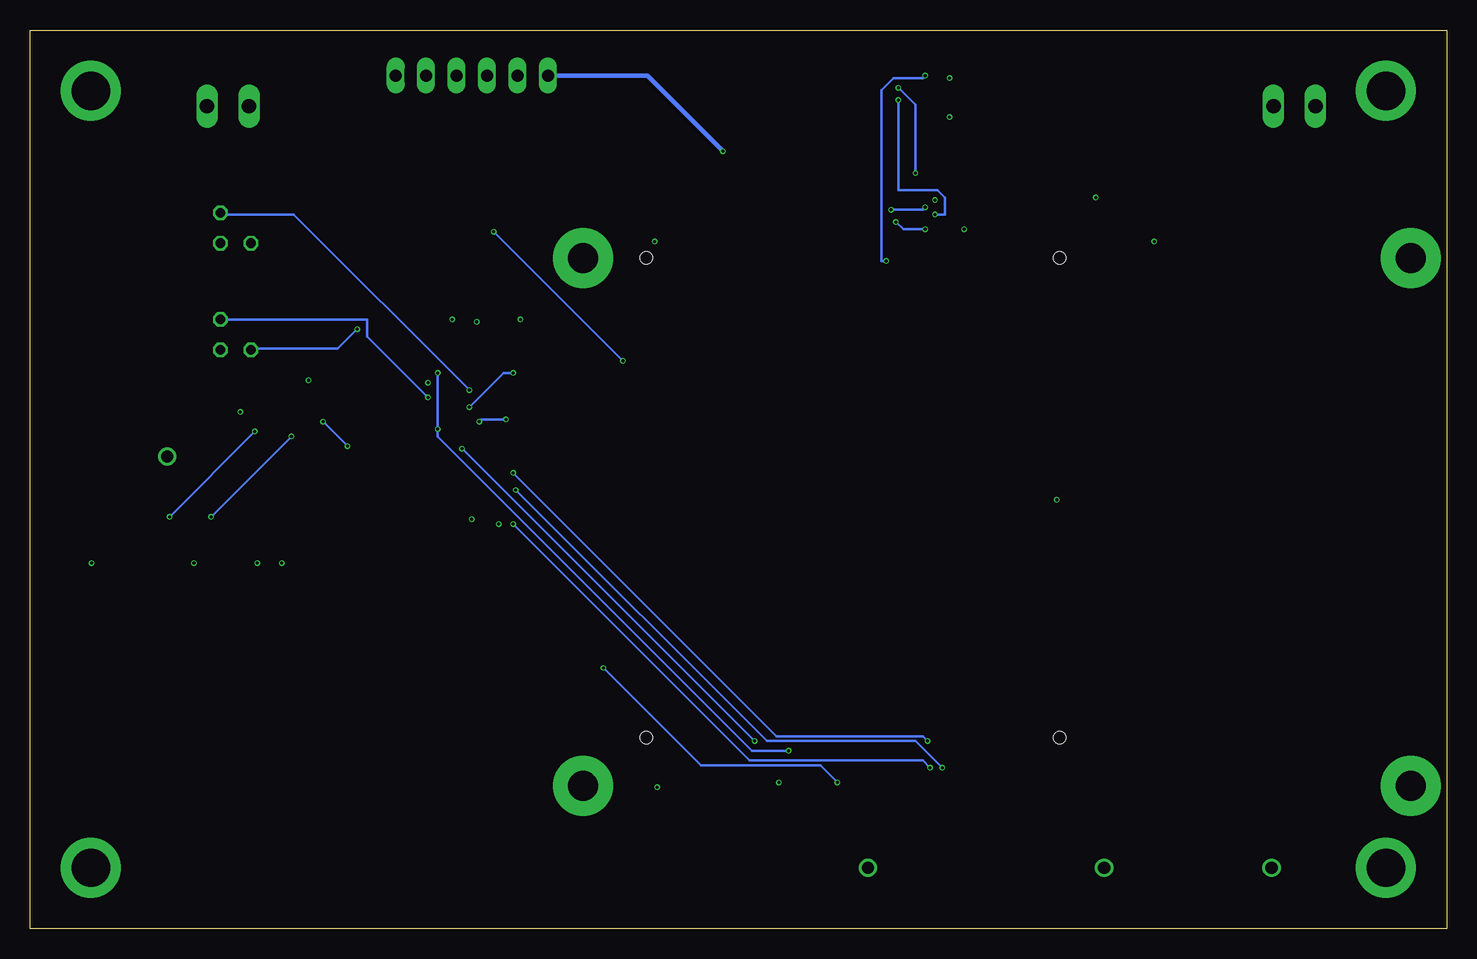
[diagram p7: board, bottom side, seen from below]

Size 118.11 x 74.93 mm. Coordinates in mm from the lower left corner, seen from the top.
Outline: 0,0 118.11,0 118.11,74.93 0,74.93 0,0
Copper layers (1*2*15*16): Top 0.035559375mm / dielectric 0.17018125mm / Route2 0.01778125mm / dielectric 47mil / Route15 0.01778125mm / dielectric 0.17018125mm / Bottom 0.035559375mm
Design rules "ohs-park-4-layer": minimum track width 5mil, minimum drill 10mil, track to track 5mil, track to pad 5mil, pad to pad 5mil, via to via 5mil, smd to smd 5mil, copper to edge 15mil, drill to drill 5mil, minimum pad ring 4mil, minimum via ring 4mil, stop-mask expansion 4mil, vias tented up to drill 100mil, thermal gap 10mil
vRestrict: area 77.5,3.8 to 109.2,5.6; area 77.5,14 to 102.9,15.7; area 77.5,7.6 to 111.8,9.4; area 77.7,17 to 102.4,25.4; area 77.5,10.2 to 111.8,11.9; area 38.7,63.5 to 47.6,67.3; area 73,63.2 to 89.5,67.1

### Footprints (pad centres in the part's own frame; a part is rotated, then mirrored left to right if it is on the bottom)
TESTPOINT = drill 1.016: 1 0,0
OPALKELLY_XEM6010 = drill 2.5 pad 5: HOLE_NC_1 3,3; HOLE_NC_2 3,47; HOLE_NC_3 72,3; HOLE_NC_4 72,47 | smd 0.457 x 1.448: JP2-1 33.9,8.086; JP2-2 33.9,1.914; JP2-3 34.7,8.086; JP2-4 34.7,1.914; JP2-5 35.5,8.086; JP2-6 35.5,1.914; JP2-7 36.3,8.086; JP2-8 36.3,1.914; JP2-9 37.1,8.086; JP2-10 37.1,1.914; JP2-11 37.9,8.086; JP2-12 37.9,1.914; JP2-13 38.7,8.086; JP2-14 38.7,1.914; JP2-15 39.5,8.086; JP2-16 39.5,1.914; JP2-17 40.3,8.086; JP2-18 40.3,1.914; JP2-19 41.1,8.086; JP2-20 41.1,1.914; JP2-21 41.9,8.086; JP2-22 41.9,1.914; JP2-23 42.7,8.086; JP2-24 42.7,1.914; JP2-25 43.5,8.086; JP2-26 43.5,1.914; JP2-27 44.3,8.086; JP2-28 44.3,1.914; JP2-29 45.1,8.086; JP2-30 45.1,1.914; JP2-31 45.9,8.086; JP2-32 45.9,1.914; JP2-33 46.7,8.086; JP2-34 46.7,1.914; JP2-35 47.5,8.086; JP2-36 47.5,1.914; JP2-37 48.3,8.086; JP2-38 48.3,1.914; JP2-39 49.1,8.086; JP2-40 49.1,1.914; JP2-41 49.9,8.086; JP2-42 49.9,1.914; JP2-43 50.7,8.086; JP2-44 50.7,1.914; JP2-45 51.5,8.086; JP2-46 51.5,1.914; JP2-47 52.3,8.086; JP2-48 52.3,1.914; JP2-49 53.1,8.086; JP2-50 53.1,1.914; JP2-51 53.9,8.086; JP2-52 53.9,1.914; JP2-53 54.7,8.086; JP2-54 54.7,1.914; JP2-55 55.5,8.086; JP2-56 55.5,1.914; JP2-57 56.3,8.086; JP2-58 56.3,1.914; JP2-59 57.1,8.086; JP2-60 57.1,1.914; JP2-61 57.9,8.086; JP2-62 57.9,1.914; JP2-63 58.7,8.086; JP2-64 58.7,1.914; JP2-65 59.5,8.086; JP2-66 59.5,1.914; JP2-67 60.3,8.086; JP2-68 60.3,1.914; JP2-69 61.1,8.086; JP2-70 61.1,1.914; JP2-71 61.9,8.086; JP2-72 61.9,1.914; JP2-73 62.7,8.086; JP2-74 62.7,1.914; JP2-75 63.5,8.086; JP2-76 63.5,1.914; JP2-77 64.3,8.086; JP2-78 64.3,1.914; JP2-79 65.1,8.086; JP2-80 65.1,1.914; JP3-1 33.9,48.086; JP3-2 33.9,41.914; JP3-3 34.7,48.086; JP3-4 34.7,41.914; JP3-5 35.5,48.086; JP3-6 35.5,41.914; JP3-7 36.3,48.086; JP3-8 36.3,41.914; JP3-9 37.1,48.086; JP3-10 37.1,41.914; JP3-11 37.9,48.086; JP3-12 37.9,41.914; JP3-13 38.7,48.086; JP3-14 38.7,41.914; JP3-15 39.5,48.086; JP3-16 39.5,41.914; JP3-17 40.3,48.086; JP3-18 40.3,41.914; JP3-19 41.1,48.086; JP3-20 41.1,41.914; JP3-21 41.9,48.086; JP3-22 41.9,41.914; JP3-23 42.7,48.086; JP3-24 42.7,41.914; JP3-25 43.5,48.086; JP3-26 43.5,41.914; JP3-27 44.3,48.086; JP3-28 44.3,41.914; JP3-29 45.1,48.086; JP3-30 45.1,41.914; JP3-31 45.9,48.086; JP3-32 45.9,41.914; JP3-33 46.7,48.086; JP3-34 46.7,41.914; JP3-35 47.5,48.086; JP3-36 47.5,41.914; JP3-37 48.3,48.086; JP3-38 48.3,41.914; JP3-39 49.1,48.086; JP3-40 49.1,41.914; JP3-41 49.9,48.086; JP3-42 49.9,41.914; JP3-43 50.7,48.086; JP3-44 50.7,41.914; JP3-45 51.5,48.086; JP3-46 51.5,41.914; JP3-47 52.3,48.086; JP3-48 52.3,41.914; JP3-49 53.1,48.086; JP3-50 53.1,41.914; JP3-51 53.9,48.086; JP3-52 53.9,41.914; JP3-53 54.7,48.086; JP3-54 54.7,41.914; JP3-55 55.5,48.086; JP3-56 55.5,41.914; JP3-57 56.3,48.086; JP3-58 56.3,41.914; JP3-59 57.1,48.086; JP3-60 57.1,41.914; JP3-61 57.9,48.086; JP3-62 57.9,41.914; JP3-63 58.7,48.086; JP3-64 58.7,41.914; JP3-65 59.5,48.086; JP3-66 59.5,41.914; JP3-67 60.3,48.086; JP3-68 60.3,41.914; JP3-69 61.1,48.086; JP3-70 61.1,41.914; JP3-71 61.9,48.086; JP3-72 61.9,41.914; JP3-73 62.7,48.086; JP3-74 62.7,41.914; JP3-75 63.5,48.086; JP3-76 63.5,41.914; JP3-77 64.3,48.086; JP3-78 64.3,41.914; JP3-79 65.1,48.086; JP3-80 65.1,41.914 | hole 1.016: 32.261,47.032; 66.739,47.032; 32.261,7.032; 66.739,7.032
1206 = smd 1.219 x 1.88: 1 -1.651,0; 2 1.651,0
0603 = smd 0.889 x 1.067: 1 -0.864,0; 2 0.864,0
0805 = smd 0.965 x 1.524: 1 -1.041,0; 2 1.041,0
SCREW_HOLE_4-40 = drill 3.2 pad 5: 1 0,0
OMNETICS_PZN-12-AA = smd 0.381 x 0.762: B1 1.587,-1.016; B2 0.953,-1.016; B3 0.318,-1.016; B4 -0.318,-1.016; B5 -0.953,-1.016; B6 -1.587,-1.016 | smd 0.381 x 1.016: T1 1.587,-2.159; T2 0.953,-2.159; T3 0.318,-2.159; T4 -0.318,-2.159; T5 -0.953,-2.159; T6 -1.587,-2.159
TO18A = drill 0.813 octagon: B 1.27,-1.27; C 1.27,1.27; E -1.27,-1.27
TO18 = drill 0.813 octagon: 1 -1.27,-1.27; 2 1.27,-1.27; 3 1.27,1.27
TERMINAL_BLOCK_3.5MM_2_3.3V = drill 1.2 long: 1 -1.75,0; 2 1.75,0
TERMINAL_BLOCK_3.5MM_2_3.5V = drill 1.2 long: 1 -1.75,0; 2 1.75,0
WIRES-6 = drill 1 long: 1 -6.35,0; 2 -3.81,0; 3 -1.27,0; 4 1.27,0; 5 3.81,0; 6 6.35,0
SOT-23-6 = smd 0.55 x 1: 1 -0.95,-1.35; 2 0,-1.35; 3 0.95,-1.35; 4 0.95,1.35; 5 0,1.35; 6 -0.95,1.35
SOT-23-5 = smd 0.55 x 1: 1 -0.95,-1.35; 2 0,-1.35; 3 0.95,-1.35; 4 0.95,1.35; 5 -0.95,1.35
SOIC-14 = smd 0.6 x 1.55: 1 -3.81,-2.7; 2 -2.54,-2.7; 3 -1.27,-2.7; 4 0,-2.7; 5 1.27,-2.7; 6 2.54,-2.7; 7 3.81,-2.7; 8 3.81,2.7; 9 2.54,2.7; 10 1.27,2.7; 11 0,2.7; 12 -1.27,2.7; 13 -2.54,2.7; 14 -3.81,2.7
TSSOP-16 = smd 0.348 x 1.397: 1 -2.273,-2.814; 2 -1.623,-2.815; 3 -0.973,-2.815; 4 -0.323,-2.815; 5 0.327,-2.815; 6 0.977,-2.815; 7 1.627,-2.815; 8 2.277,-2.815; 9 2.277,2.825; 10 1.627,2.825; 11 0.977,2.825; 12 0.327,2.825; 13 -0.323,2.825; 14 -0.973,2.825; 15 -1.623,2.825; 16 -2.273,2.825
SOT-23-RJ-8 = smd 0.4 x 1: 1 -0.975,-1.3; 2 -0.325,-1.3; 3 0.325,-1.3; 4 0.975,-1.3; 5 0.975,1.3; 6 0.325,1.3; 7 -0.325,1.3; 8 -0.975,1.3

### Placement (x,y rotation side)
+3.3V_FPGA_1  28.57,5.08 0 top
+5V  14.61,5.08 0 top
BRD1  0,8.89 0 top
C1  31.11,33.02 270 top
C2  21.59,63.5 0 top
C3  26.67,69.85 0 top
C4  26.67,60.96 0 top
C5  30.48,64.77 270 top
C6  36.2,69.22 270 top
C7  57.78,70.48 0 top
C8  53.34,66.67 90 top
C9  66.04,65.41 90 top
C10  55.24,61.59 270 top
C11  80.01,32.38 180 top
C12  90.81,55.88 0 top
C13  80.01,49.53 180 top
GND_1  48.26,5.08 0 top
GND_2  106.68,39.37 0 top
H1  5.08,69.85 0 top
H2  113.03,69.85 0 top
H3  113.03,5.08 0 top
H4  5.08,5.08 0 top
LOGO1  77.47,16.51 0 top
PORT_A  43.18,70.92 0 top
Q1  100.97,49.53 0 top
Q2  100.97,58.42 0 top
R1  21.59,69.85 0 top
R2  21.59,67.31 180 top
R3  87.63,33.02 90 top
R4  92.71,33.02 90 top
R5  97.16,32.38 90 top
R6  100.33,32.38 90 top
R7  103.5,32.38 90 top
R8  106.68,32.38 90 top
R9  109.86,32.38 90 top
R10  113.03,32.38 90 top
R11  76.83,60.96 270 top
R12  80.01,60.96 270 top
R13  83.19,60.96 270 top
S1  101.6,68.58 180 top
S2  12.7,68.58 180 top
S3  81.28,71.12 0 top
U1  26.67,66.04 180 top
U2  58.42,66.04 180 top
U3  90.81,48.26 270 top
U4  97.79,40.01 270 top
U5  80.01,53.98 270 top
U6  80.01,43.18 270 top
U7  80.01,36.2 90 top

### Tracks (layer width: path | path; a pad name or v marks a point on that pad's centre or on a via)
+3V3
  Top 0.381: BRD1.JP2-2 33.93,10.77 34.54,10.77 BRD1.JP2-4 34.75,10.77 35.36,10.77 BRD1.JP2-6 | BRD1.JP2-2 33.73,10.77 28.65,5.69 28.65,5.08 +3.3V_FPGA_1.1 | BRD1.JP3-34 46.74,51 46.53,51.21 46.53,51.82 42.67,55.68 38.81,55.68 38.81,56.9 BRD1.JP3-13 38.61,57.1 38,57.1 BRD1.JP3-11 37.8,57.1 37.19,57.1 BRD1.JP3-9 36.98,57.1 36.98,58.12 32.92,58.12 29.67,54.86 29.67,15.04 BRD1.JP2-2
+3V3DAC  (via drill 0.25)
  Top 0.381: 86.16,45.52 86.77,45.52 86.77,47.35 87.58,48.16 87.99,48.16 U3.4 | 86.16,45.52 v84.94,45.52 82.91,45.52 U6.16 | 86.16,45.52 86.16,32.92 87.58,31.5 R3.1 | U5.2 77.01,55.68 76,55.68 76,56.49 76.4,56.9 82.7,56.9 82.7,56.29 U5.16 82.91,56.29 85.34,56.29 85.75,55.88 C12.1 90.02,55.88 99.77,65.63 99.77,68.48 S1.2 | 104.55,30.58 105.66,29.46 109.73,29.46 109.73,31.5 R9.1 | 104.55,30.58 103.63,31.5 R7.1 | C10.1 55.27,62.59 57.3,62.59 59.33,64.62 U2.5 59.54,64.82 v60.35,64.82 | U7.2 81.28,35.76 81.28,35.36 U7.1 81.28,35.15 v81.28,34.14 81.28,32.92 80.87,32.51 C11.1 | v80.87,50.6 C13.1 | v97.13,30.48 97.13,31.5 R5.1 | v100.58,43.08 100.58,42.27 U4.16 | S3.1 73.36,71.12 66.04,63.8 C9.1 | v104.44,30.48 104.55,30.58
  Bottom 0.381: v60.35,64.82 66.65,71.12 S3.1
  pour Route15: 69.85,1.27 69.85,73.66 115.57,73.66 115.57,1.27
+3V5  (via drill 0.25)
  Top 0.381: U1.6 27.64,64.82 30.48,64.82 C5.1 30.48,69.9 | 30.48,69.9 36.17,69.9 C6.1 | v41.45,70.92 41.45,69.9 PORT_A.B6 | 20.73,66.24 13.21,66.24 10.97,68.48 S2.2 10.97,68.68 10.97,71.73 28.65,71.73 30.48,69.9 | R2.2 20.73,66.24 | 20.73,66.24 C2.1
  pour Route15: 8.89,73.66 8.89,59.69 46.99,59.69 46.99,73.66
+5V  (via drill 0.25)
  Top 0.381: BRD1.JP3-5 35.36,57.1 34.75,57.1 BRD1.JP3-3 34.54,57.1 33.93,57.1 BRD1.JP3-1 33.73,56.9 33.73,55.68 32.92,54.86 32.92,36.37 32.41,35.87 | 32.41,35.87 31.29,34.75 C1.1 | 56.9,70.31 56.9,67.87 57.3,67.46 U2.3 | 56.9,70.31 59.33,67.87 59.33,67.46 U2.1 59.54,67.26 66.04,60.76 v66.04,57.3 | 56.9,70.31 C7.1 | 25.81,69.7 25.81,67.46 U1.3 25.6,67.26 24.38,66.04 v24.38,57.3 | 25.81,69.7 27.43,68.07 27.43,67.46 U1.1 | 25.81,69.7 C3.1 | v32.51,35.76 32.41,35.87
  Route15 0.381: v24.38,57.3 24.38,57.15 | v66.04,57.3 66.04,57.15
  pour Route15: 1.27,1.27 1.27,57.15 68.58,57.15 68.58,1.27
ELEC_TEST
  Top 0.203: U6.4 77.01,43.48 75.39,43.48 75.39,57.1 79.05,60.76 79.05,70.31 79.86,71.12 S3.3
ELEC_TEST1
  Top 0.203: R11.1 77.01,61.98 77.42,62.38 77.42,71.12 S3.2
ELEC_TEST2
  Top 0.203: R12.1 80.06,61.98 81.89,63.8 81.89,70.51 82.5,71.12 S3.4
GND  (via drill 0.25)
  Top 0.381: 46.02,49.89 46.33,49.58 48.16,49.58 48.16,50.8 BRD1.JP3-38 | 46.02,49.89 45.92,49.99 45.92,50.8 BRD1.JP3-32 | BRD1.JP3-40 48.97,50.8 48.36,50.8 BRD1.JP3-38 | 47.55,55.68 47.55,52.43 48.16,51.82 48.16,51 BRD1.JP3-38 | 47.55,55.68 47.55,56.9 BRD1.JP3-35 | 46.02,49.89 45.92,49.78 45.92,49.58 39.01,49.58 38.81,49.78 38.81,50.8 BRD1.JP3-14 38.61,51 38.61,52.02 34.34,52.02 33.93,51.61 33.93,51 BRD1.JP3-2 33.73,50.8 33.53,50.6 33.53,29.26 33.43,29.16 | C9.2 66.04,70.31 58.93,70.31 C7.2 58.73,70.51 57.51,71.73 55.68,71.73 55.68,66.45 | 58.52,67.46 U2.2 58.32,67.26 58.32,66.85 57.91,66.45 55.68,66.45 | 55.68,66.45 54.25,66.45 54.25,66.65 53.44,67.46 C8.2 53.24,67.46 52.22,66.45 52.22,63.6 55.07,60.76 C10.2 55.27,60.55 55.47,60.35 55.47,57.1 BRD1.JP3-55 55.68,56.9 55.68,55.68 | BRD1.JP3-80 65.02,50.8 64.41,50.8 BRD1.JP3-78 64.21,51 64.21,51.61 60.15,55.68 55.68,55.68 | 55.68,55.68 47.55,55.68 | 38.81,15.85 38.81,16.87 BRD1.JP2-13 | 38.81,15.85 38.81,10.97 BRD1.JP2-14 38.81,10.77 38.81,9.96 39.22,9.55 47.55,9.55 | 38.81,15.85 34.14,15.85 33.93,16.05 33.93,16.87 BRD1.JP2-1 33.73,17.07 33.73,28.85 33.43,29.16 | 33.43,29.16 31.29,31.29 C1.2 | 78.64,35.15 U7.8 78.84,35.15 79.05,34.95 v79.05,33.73 79.05,32.92 | 79.05,32.92 79.05,32.51 C11.2 | 77.22,41.66 77.22,42.06 U6.6 | U5.12 82.7,53.65 81.89,53.65 80.06,51.82 80.06,50.39 79.25,49.58 C13.2 79.25,49.38 79.25,41.66 77.22,41.66 | 77.22,41.66 U6.7 77.22,41.45 77.22,41.05 U6.8 77.01,40.84 76.81,40.64 76.81,32.92 79.05,32.92 | 94.89,38.41 94.89,37.8 U4.8 94.89,37.59 94.89,33.53 92.86,31.5 R4.1 | 94.59,38.71 94.89,39.01 U4.6
  Top 0.381: 94.59,38.71 90.83,34.95 90.83,29.46 98.15,29.46 v99.16,30.48 100.18,31.5 R6.1 | 94.59,38.71 94.89,38.41 | 94.89,38.41 U4.7 | C4.2 v29.26,60.96 30.48,60.96 30.48,62.59 | 30.48,62.59 C5.2 30.48,62.99 | 30.48,62.59 36.17,68.28 C6.2 | U3.13 93.47,50.8 93.47,49.58 U3.12 93.47,49.38 93.47,48.36 U3.11 93.47,48.16 93.47,47.14 U3.10 93.47,46.94 93.47,45.72 U3.9 v94.89,45.72 | 26.62,67.46 U1.2 26.82,67.26 26.82,66.85 27.23,66.45 28.45,66.45 28.45,69.09 27.84,69.7 C3.2 27.64,69.9 26.42,71.12 20.73,71.12 R1.1 20.73,69.7 14.63,69.7 14.63,68.68 S2.1 | U5.6 77.22,52.83 77.22,52.43 U5.7 77.22,52.22 77.22,51.82 U5.8 77.22,51.61 v77.22,50.8 | BRD1.JP2-78 64.41,10.77 65.02,10.77 BRD1.JP2-80 65.23,10.97 65.84,11.58 v65.84,11.79 | 41.45,68.89 PORT_A.T6 41.45,68.68 v41.45,67.67 | R8.1 106.68,31.7 105.66,32.72 105.66,38.2 106.68,39.22 GND_2.1 | v112.98,30.48 112.98,31.5 R10.1 | C12.2 91.85,55.88 103.23,67.26 103.23,68.48 S1.1 | v82.91,50.8 82.91,51.61 U5.9 | 47.55,9.55 47.55,5.69 48.16,5.08 GND_1.1 | 47.55,9.55 47.55,10.77 BRD1.JP2-36 | v55.68,12.19 55.68,10.97 BRD1.JP2-56
  pour Route2: 1.27,73.66 115.57,73.66 115.57,1.27 1.27,1.27
I_MODE_EN  (via drill 0.25)
  Top 0.203: v82.09,40.03 82.09,40.23 82.7,40.84 U6.9 | v57.71,15.65 54.05,11.99 52.63,11.99 52.63,11.79 52.43,11.58 52.43,10.97 BRD1.JP2-48
  Bottom 0.203: v57.71,15.65 v82.09,40.03
I_SINK_EN  (via drill 0.25)
  Top 0.203: 80.06,31.5 81.48,31.5 82.3,32.31 82.3,37.39 81.28,38.41 81.28,42.06 82.7,42.06 U6.11 | 80.06,31.5 80.06,42.06 79.86,42.27 79.86,46.94 81.69,48.77 81.69,52.63 81.89,52.83 82.7,52.83 U5.11 | v50.8,12.19 50.8,10.97 BRD1.JP2-44 | 80.06,31.5 v70.31,21.74
  Bottom 0.203: v50.8,12.19 52.22,13.61 62.18,13.61 v70.31,21.74
I_SOURCE_EN  (via drill 0.25)
  Top 0.203: v84.12,41.66 82.91,41.66 U6.10 | v84.12,46.33 83.92,46.53 83.92,52.02 83.72,52.22 82.91,52.22 U5.10 | v54.86,14.83 51.61,11.58 51.61,10.97 BRD1.JP2-46
  Bottom 0.203: v84.12,46.33 v84.12,41.66 84.12,41.05 57.91,14.83 v54.86,14.83
N$1
  Top 0.203: PORT_A.B4 42.88,69.9 42.88,70.71 42.67,70.92 42.67,71.32 41.86,72.14 39.42,72.14 39.42,57.1 BRD1.JP3-15
N$2  (via drill 0.25)
  Top 0.203: v42.67,60.76 42.88,60.96 42.88,68.68 PORT_A.T4 | v40.23,58.32 40.23,57.1 BRD1.JP3-17
  Route2 0.203: v40.23,58.32 v42.67,60.76
N$3
  Top 0.203: PORT_A.B5 42.27,69.9 42.27,71.12 41.66,71.73 40.64,71.73 40.64,58.93 41.05,58.52 41.05,57.1 BRD1.JP3-19
N$4
  Top 0.203: PORT_A.T5 42.27,68.68 42.27,61.37 41.86,60.96 41.86,57.1 BRD1.JP3-21
N$5  (via drill 0.25)
  Top 0.203: v45.72,69.09 44.91,69.9 PORT_A.B1 | v42.67,59.54 42.67,57.1 BRD1.JP3-23
  Bottom 0.203: v45.72,69.09 45.72,61.57 42.47,61.57 41.86,60.96 41.86,59.54 v42.67,59.54
N$6  (via drill 0.25)
  Top 0.203: v45.92,58.93 45.52,59.33 45.52,68.07 44.91,68.68 PORT_A.T1 | v43.48,58.32 43.48,57.1 BRD1.JP3-25
  Bottom 0.203: v45.92,58.93 45.31,58.32 v43.48,58.32
N$7  (via drill 0.25)
  Top 0.203: v45.72,70.1 45.72,70.71 44.5,70.71 44.09,70.31 44.09,69.9 PORT_A.B2 | v44.3,62.99 44.3,57.1 BRD1.JP3-27
  Bottom 0.203: v45.72,70.1 44.3,68.68 v44.3,62.99
N$8
  Top 0.203: PORT_A.T2 44.09,68.68 44.09,64.21 45.11,63.2 45.11,57.1 BRD1.JP3-29
N$9  (via drill 0.25)
  Top 0.203: v43.48,71.12 43.48,69.9 PORT_A.B3 | v46.74,55.68 45.92,55.68 45.92,56.9 BRD1.JP3-31
  Bottom 0.203: v43.48,71.12 43.69,70.92 46.13,70.92 47.14,69.9 47.14,55.68 v46.74,55.68
N$10  (via drill 0.25)
  Top 0.203: v43.48,60.15 43.48,68.68 PORT_A.T3 | v46.33,59.94 46.74,59.54 46.74,57.1 BRD1.JP3-33
  Bottom 0.203: v43.48,60.15 43.69,59.94 v46.33,59.94
N$11
  Top 0.203: 88.19,52.22 U3.1 89.86,52.07 95.91,58.12 103.23,58.12 103.23,49.17 102.41,48.36 Q1.B
N$12  (via drill 0.25)
  Top 0.203: 81.89,54.46 81.69,54.66 81.69,56.29 77.22,56.29 U5.1 | 81.89,54.46 82.7,54.46 U5.13 | U7.3 81.28,36.58 81.28,36.98 U7.4 81.28,37.19 80.67,37.8 v80.67,42.27 | 78.03,42.88 v78.44,42.47 | 78.03,42.88 77.22,42.88 U6.5 | 81.89,54.46 78.23,50.8 78.23,46.94 78.64,46.53 78.64,43.48 78.03,42.88
  Bottom 0.203: v80.67,42.27 80.47,42.47 v78.44,42.47
N$13
  Top 0.203: U5.14 82.91,54.86 84.94,54.86 84.94,51.82 87.17,49.58 87.99,49.58 U3.3
N$14  (via drill 0.25)
  Top 0.203: v84.94,44.3 82.91,44.3 U6.14
  Bottom 0.203: v84.94,44.3 90.02,49.38 90.02,50.8 Q1.C
N$15
  Top 0.203: U5.15 82.91,55.47 85.34,55.47 85.34,52.02 87.17,50.19 89.2,50.19 89.2,47.75 88.59,47.14 88.19,47.14 U3.5
N$16
  Top 0.203: U3.7 88.19,44.5 92.25,44.5 92.25,52.43 95.91,56.08 102.21,56.08 102.21,57.1 Q2.2
N$17  (via drill 0.25)
  Top 0.203: v81.48,44.91 82.7,44.91 U6.15
  Bottom 0.203: v81.48,44.91 96.11,59.54 102.21,59.54 Q2.3
N$18
  Top 0.203: R11.2 76.81,59.94 69.09,59.94 69.09,47.95 69.49,47.55 69.49,13.41 66.04,9.96 66.04,9.55 65.84,9.35 54.86,9.35 54.86,10.77 BRD1.JP2-54
N$19  (via drill 0.25)
  Top 0.203: R12.2 79.45,59.54 v79.45,58.12 | v68.68,47.35 68.28,46.94 68.28,12.8 65.63,10.16 65.63,9.75 56.49,9.75 56.49,10.77 BRD1.JP2-58
  Bottom 0.203: v68.68,47.35 v79.45,58.12
N$20
  Top 0.203: R9.2 109.93,33.12 112.17,33.12 112.17,32.51 112.37,32.31 114,32.31 114,34.95 100.79,48.16 100.79,48.56 99.97,49.38 97.13,49.38 97.13,40.84 96.52,40.23 95.1,40.23 U4.4
N$21  (via drill 0.25)
  Top 0.203: R7.2 103.02,33.73 v103.02,34.34 | v96.32,41.05 95.71,41.66 95.1,41.66 U4.2
  Bottom 0.203: v96.32,41.05 v103.02,34.34
N$22
  Top 0.203: R5.2 97.13,33.33 96.11,34.34 96.11,39.22 95.71,39.62 95.1,39.62 U4.5
N$23  (via drill 0.25)
  Top 0.203: v93.67,42.27 94.89,42.27 U4.1 | v91.64,40.23 87.78,36.37 87.78,34.75 R3.2
  Bottom 0.203: v91.64,40.23 v93.67,42.27
N$24
  Top 0.203: U4.12 100.58,39.62 99.57,39.62 99.57,35.56 101.19,33.93 101.19,32.51 100.99,32.31 94.49,32.31 94.49,31.09 93.67,30.28 91.44,30.28 91.44,33.33 92.66,34.54 R4.2
N$25
  Top 0.203: R6.2 100.18,33.33 99.16,34.34 99.16,40.23 99.77,40.84 100.58,40.84 U4.14
N$26  (via drill 0.25)
  Top 0.203: v106.48,34.34 106.48,33.53 106.68,33.33 R8.2 | v99.36,41.45 99.77,41.45 99.97,41.66 100.58,41.66 U4.15
  Bottom 0.203: v99.36,41.45 v106.48,34.34
N$27
  Top 0.203: R10.2 112.98,33.33 107.9,38.41 107.9,39.83 107.29,40.44 102.21,40.44 102.21,39.83 101.4,39.01 100.79,39.01 U4.11
N$28  (via drill 0.25)
  Top 0.203: 77.83,45.31 77.22,45.31 U6.1 77.83,45.31 | 77.83,45.31 78.03,45.31 78.23,45.11 78.23,44.3 77.22,44.3 U6.3 | v81.48,43.48 82.7,43.48 U6.13 | 77.83,45.31 v77.83,46.33
  Bottom 0.203: v81.48,43.48 78.64,46.33 v77.83,46.33
N$29
  Top 0.203: R13.2 83.11,60.15 82.3,60.96 82.3,68.68 83.52,69.9 83.52,72.34 83.11,72.75 76,72.75 76,67.87 67.87,59.74 67.87,18.49 65.63,16.26 65.63,16.05 61.57,11.99 57.3,11.99 57.3,10.97 BRD1.JP2-60
N$41  (via drill 0.25)
  Top 0.203: v77.83,38 78.64,37.19 U7.5 | v43.28,15.65 39.62,11.99 39.62,10.97 BRD1.JP2-16
  Bottom 0.203: v77.83,38 55.88,16.05 43.69,16.05 v43.28,15.65
N$42  (via drill 0.25)
  Top 0.203: v77.62,36.58 78.64,36.58 U7.6 | v42.06,13.41 40.44,11.79 40.44,10.97 BRD1.JP2-18
  Bottom 0.203: v77.62,36.58 56.69,15.65 44.3,15.65 v42.06,13.41
N$43  (via drill 0.25)
  Top 0.203: v77.83,33.73 77.83,35.76 78.64,35.76 U7.7 | v43.08,13.41 41.25,11.58 41.25,10.97 BRD1.JP2-20
  Bottom 0.203: v77.83,33.73 58.12,14.02 43.69,14.02 v43.08,13.41
N$141
  Top 0.203: U2.4 57.3,64.82 53.44,64.82 53.44,65.63 C8.1
N$143
  Top 0.203: C4.1 25.81,64.62 U1.4
N$144
  Top 0.203: R1.2 22.55,69.7 22.55,67.46 R2.1 22.55,67.26 22.55,63.6 C2.2 22.55,63.4 22.55,56.49 24.59,56.49 26.62,58.52 26.62,64.62 U1.5
N$185
  Top 0.381: BRD1.JP3-4 34.75,50.8 35.36,50.8 BRD1.JP3-6
RANGE_SEL_0
  Top 0.203: U4.10 100.79,38.41 102.01,38.41 102.01,31.09 79.45,8.53 53.24,8.53 53.24,10.77 BRD1.JP2-50
RANGE_SEL_1
  Top 0.203: U4.9 100.79,37.59 101.6,36.78 101.6,31.29 79.25,8.94 54.05,8.94 54.05,10.77 BRD1.JP2-52
RBIAS_N  (via drill 0.25)
  Top 0.203: U4.13 100.79,40.44 101.8,40.44 101.8,46.13 99.77,48.16 Q1.E | U3.2 90.83,50.8 v90.83,49.99
  Bottom 0.203: v90.83,49.99 92.46,48.36 99.57,48.36 Q1.E
RBIAS_P
  Top 0.203: U4.3 94.89,41.05 86.97,41.05 86.97,44.91 87.78,45.72 U3.6 88.39,45.72 91.64,48.97 91.64,53.01 95.78,57.15 Q2.1 99.57,57.1
REF_SEL
  Top 0.203: R13.1 83.31,61.98 87.58,66.24 87.58,71.12 S3.6

### Text on the board
tPlace: R | O | Y | G | BK | BR | SPI | PLATE | Opal Kelly XEM6010 | Intan Technologies | RHD2000 ELECTROPLATING | BOARD Version 1.1 (JPN) | http://www.intantech.com